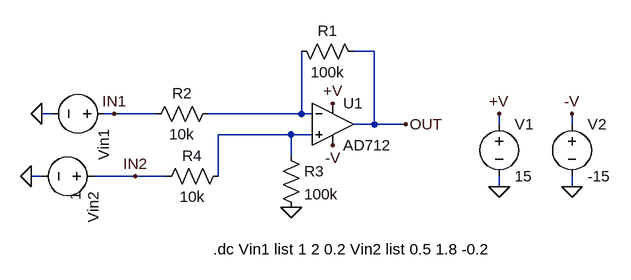
[diagram p0: schematic TwoPointInvertingSummingAmplifier.asc]
* TwoPointInvertingSummingAmplifier.asc
Vin1 IN1 0
* U1: AD712 (symbol AD712 not available, pins judged from their places): In+=N002 In-=N001 V+=+V V-=-V OUT=OUT
R1 N001 OUT 100k
R2 N001 IN1 10k
R3 N002 0 100k
V1 +V 0 15
V2 -V 0 -15
R4 N002 IN2 10k
Vin2 IN2 0 1
.dc Vin1 list 1 2 0.2 Vin2 list 0.5 1.8 -0.2
.backanno
.end

* Results of the author's LTspice run, read from the files saved beside the schematic
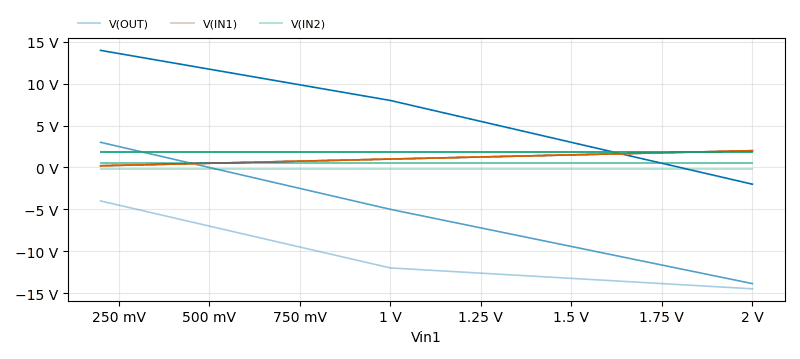
[diagram p1: DC transfer characteristic of TwoPointInvertingSummingAmplifier.asc, plotted from the saved traces]
* DC transfer characteristic, 3 runs:
*   V(OUT) [Vin2=-0.2]: -4 V at Vin1=200 mV, -14.49 V at Vin1=2 V, min -14.49 V, max -4 V
*   V(OUT) [Vin2=0.5]: 3 V at Vin1=200 mV, -13.87 V at Vin1=2 V, min -13.87 V, max 3 V
*   V(OUT) [Vin2=1.8]: 13.98 V at Vin1=200 mV, -2 V at Vin1=2 V, min -2 V, max 13.98 V
*   V(IN1) [Vin2=-0.2]: 200 mV at Vin1=200 mV, 2 V at Vin1=2 V, min 200 mV, max 2 V
*   V(IN1) [Vin2=0.5]: 200 mV at Vin1=200 mV, 2 V at Vin1=2 V, min 200 mV, max 2 V
*   V(IN1) [Vin2=1.8]: 200 mV at Vin1=200 mV, 2 V at Vin1=2 V, min 200 mV, max 2 V
*   V(IN2) [Vin2=-0.2]: -200 mV at Vin1=200 mV, -200 mV at Vin1=2 V, min -200 mV, max -200 mV
*   V(IN2) [Vin2=0.5]: 500 mV at Vin1=200 mV, 500 mV at Vin1=2 V, min 500 mV, max 500 mV
*   V(IN2) [Vin2=1.8]: 1.8 V at Vin1=200 mV, 1.8 V at Vin1=2 V, min 1.8 V, max 1.8 V